# EasyEDA schematic PicoCoffeeMachine_2021-02-28.json
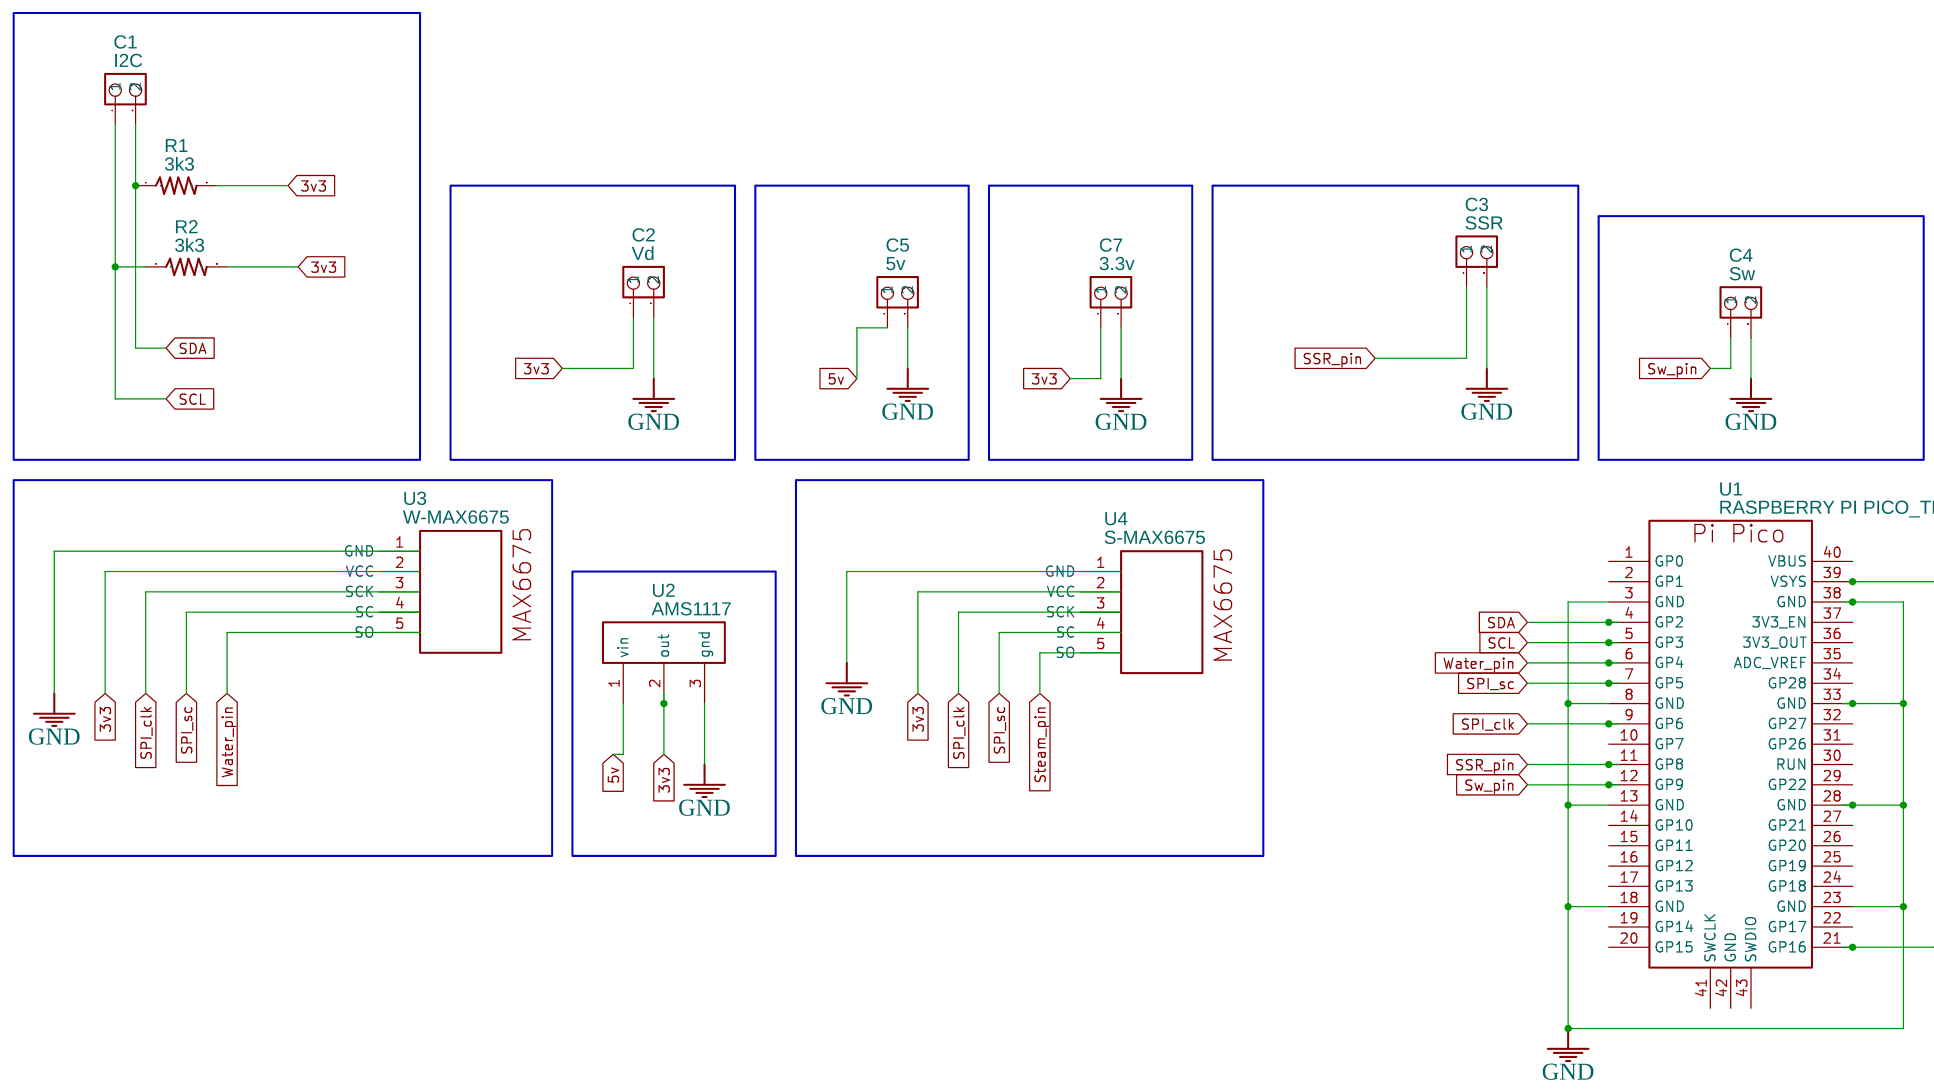
[diagram p0: schematic sheet]

## Parts
C1  I2C  [XH-2A]
C2  Vd  [XH-2A]
C3  SSR  [XH-2A]
C4  Sw  [XH-2A]
C5  5v  [XH-2A]
C7  3.3v  [XH-2A]
R1  3k3  [AXIAL-0.3]
R2  3k3  [AXIAL-0.3]
U1  RASPBERRY PI PICO_THROUGH_HOLE COPY  [RASPBERRY_PI_PICO_THROUGH_HOLE]
U2  AMS1117  [AMS1117]
U3  W-MAX6675  [THERMO COUPLE_MAX6675_MODULE_PINOUT]
U4  S-MAX6675  [THERMO COUPLE_MAX6675_MODULE_PINOUT]

## Library data of the parts
C1-C5 C7 = JST: Supplier: EasyEDA; Contributor: Sreejith Kadampuzha; DataSheet: http://www.jst-mfg.com/product/pdf/eng/eXH.pdf
R1 R2 = RESISTOR: Contributor: SparkFun
U1 = RASPBERRY PI PICO_THROUGH_HOLE COPY: Manufacturer: Raspberry Pi Foundation; Manufacturer Part: Pi Pico; Supplier: Raspberry Pi; Supplier Part: Pi Pico; link: https://datasheets.raspberrypi.org/pico/pico_datasheet.pdf; Contributor: davidg
U2 = AMS1117: Contributor: monstorkillbukinvv
U3 U4 = MAX6675: Contributor: gtmustangjim

## Nets
3v3: C2.1 C7.1 R1.2 R2.2 U1.39(VSYS) U2.2(out) U3.2(VCC) U4.2(VCC)
5v: C5.1 U2.1(vin)
GND: C2.2 C3.2 C4.2 C5.2 C7.2 U1.3(GND) U1.8(GND) U1.13(GND) U1.18(GND) U1.23(GND) U1.28(GND) U1.33(GND) U1.38(GND) U2.3(gnd) U3.1(GND) U4.1(GND)
SCL: C1.1 R2.1 U1.5(GP3)
SDA: C1.2 R1.1 U1.4(GP2)
SPI_clk: U1.9(GP6) U3.3(SCK) U4.3(SCK)
SPI_sc: U1.7(GP5) U3.4(SC) U4.4(SC)
SSR_pin: C3.1 U1.11(GP8)
Steam_pin: U1.21(GP16) U4.5(SO)
Sw_pin: C4.1 U1.12(GP9)
Water_pin: U1.6(GP4) U3.5(SO)

Not connected (* = marked no-connect by the designer): U1 1(GP0) 2(GP1) 10(GP7) 14(GP10) 15(GP11) 16(GP12) 17(GP13) 19(GP14) 20(GP15) 22(GP17) 24(GP18) 25(GP19) 26(GP20) 27(GP21) 29(GP22) 30(RUN) 31(GP26) 32(GP27) 34(GP28) 35(ADC_VREF) 36(3V3_OUT) 37(3V3_EN) 40(VBUS) 41(SWCLK) 42(GND) 43(SWDIO)
